# EAGLE schematic synth-a-phone-v1.4 (EAGLE 5.11)
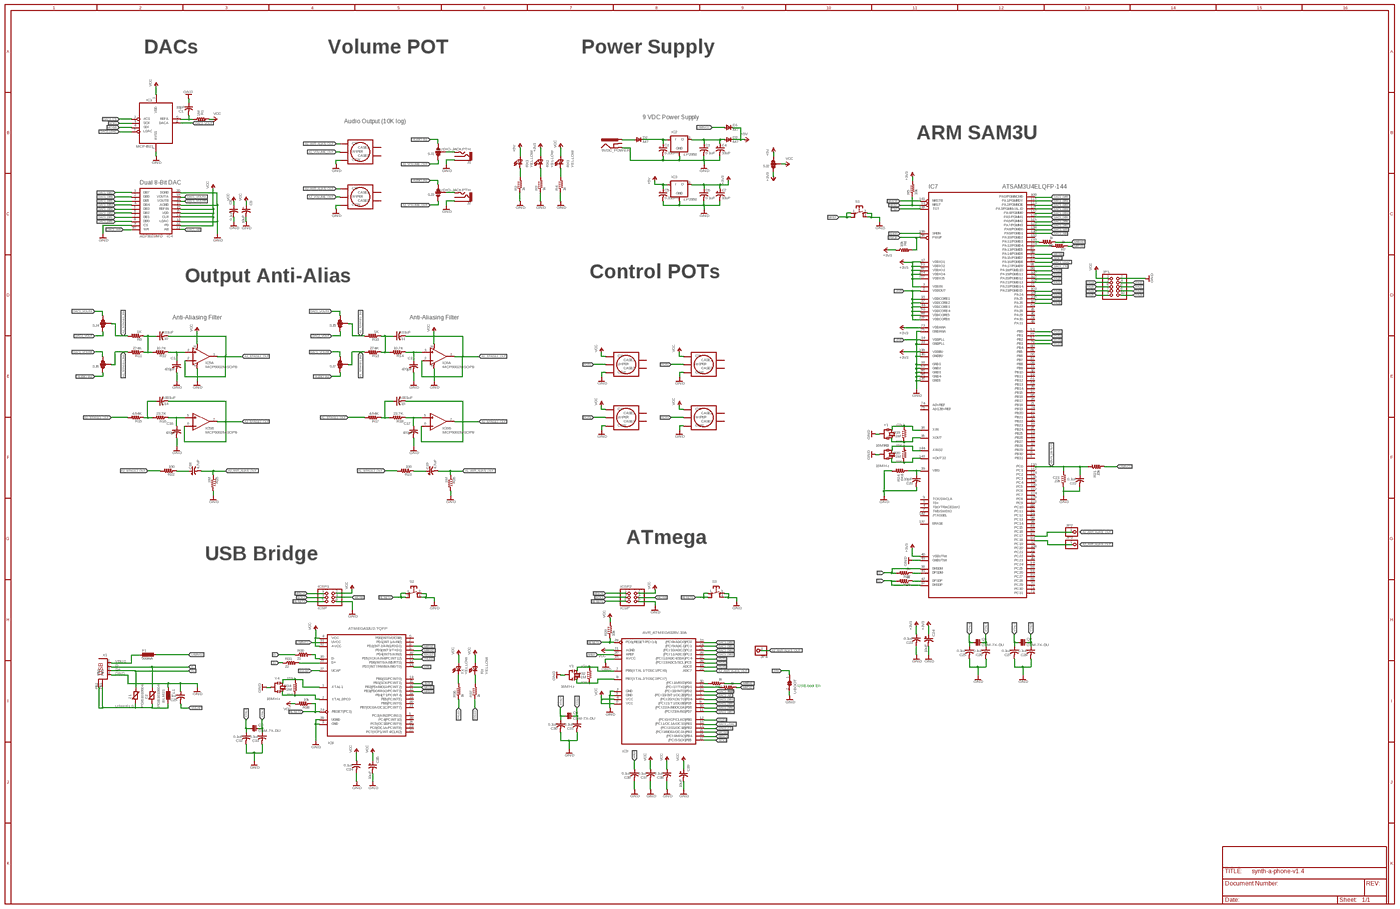
[diagram p0: schematic, sheet 1, overview]
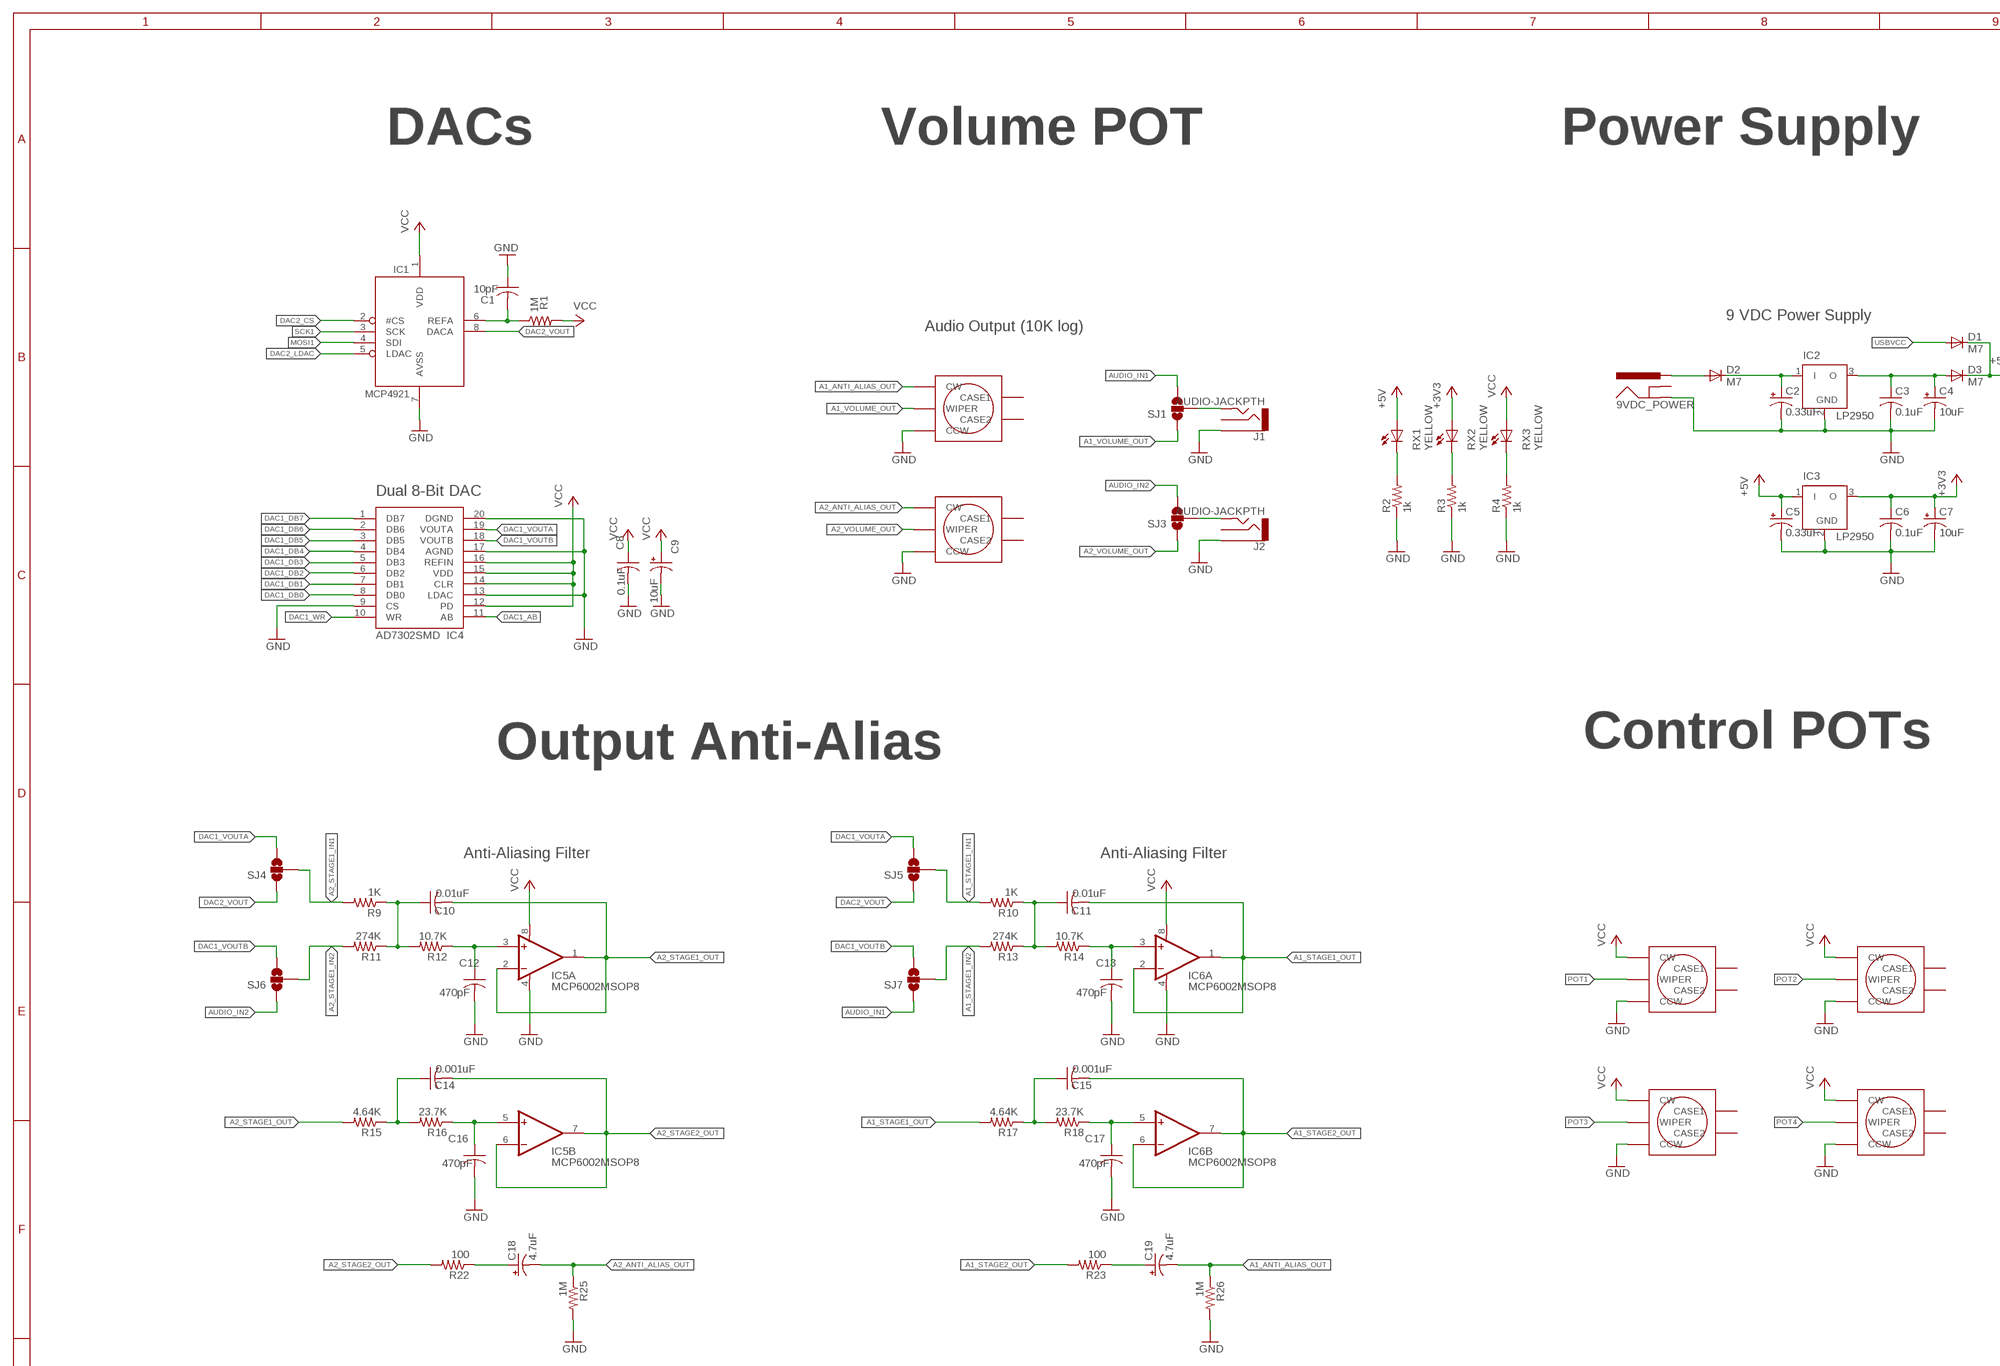
[diagram p1: schematic, sheet 1, part 1 of 4]
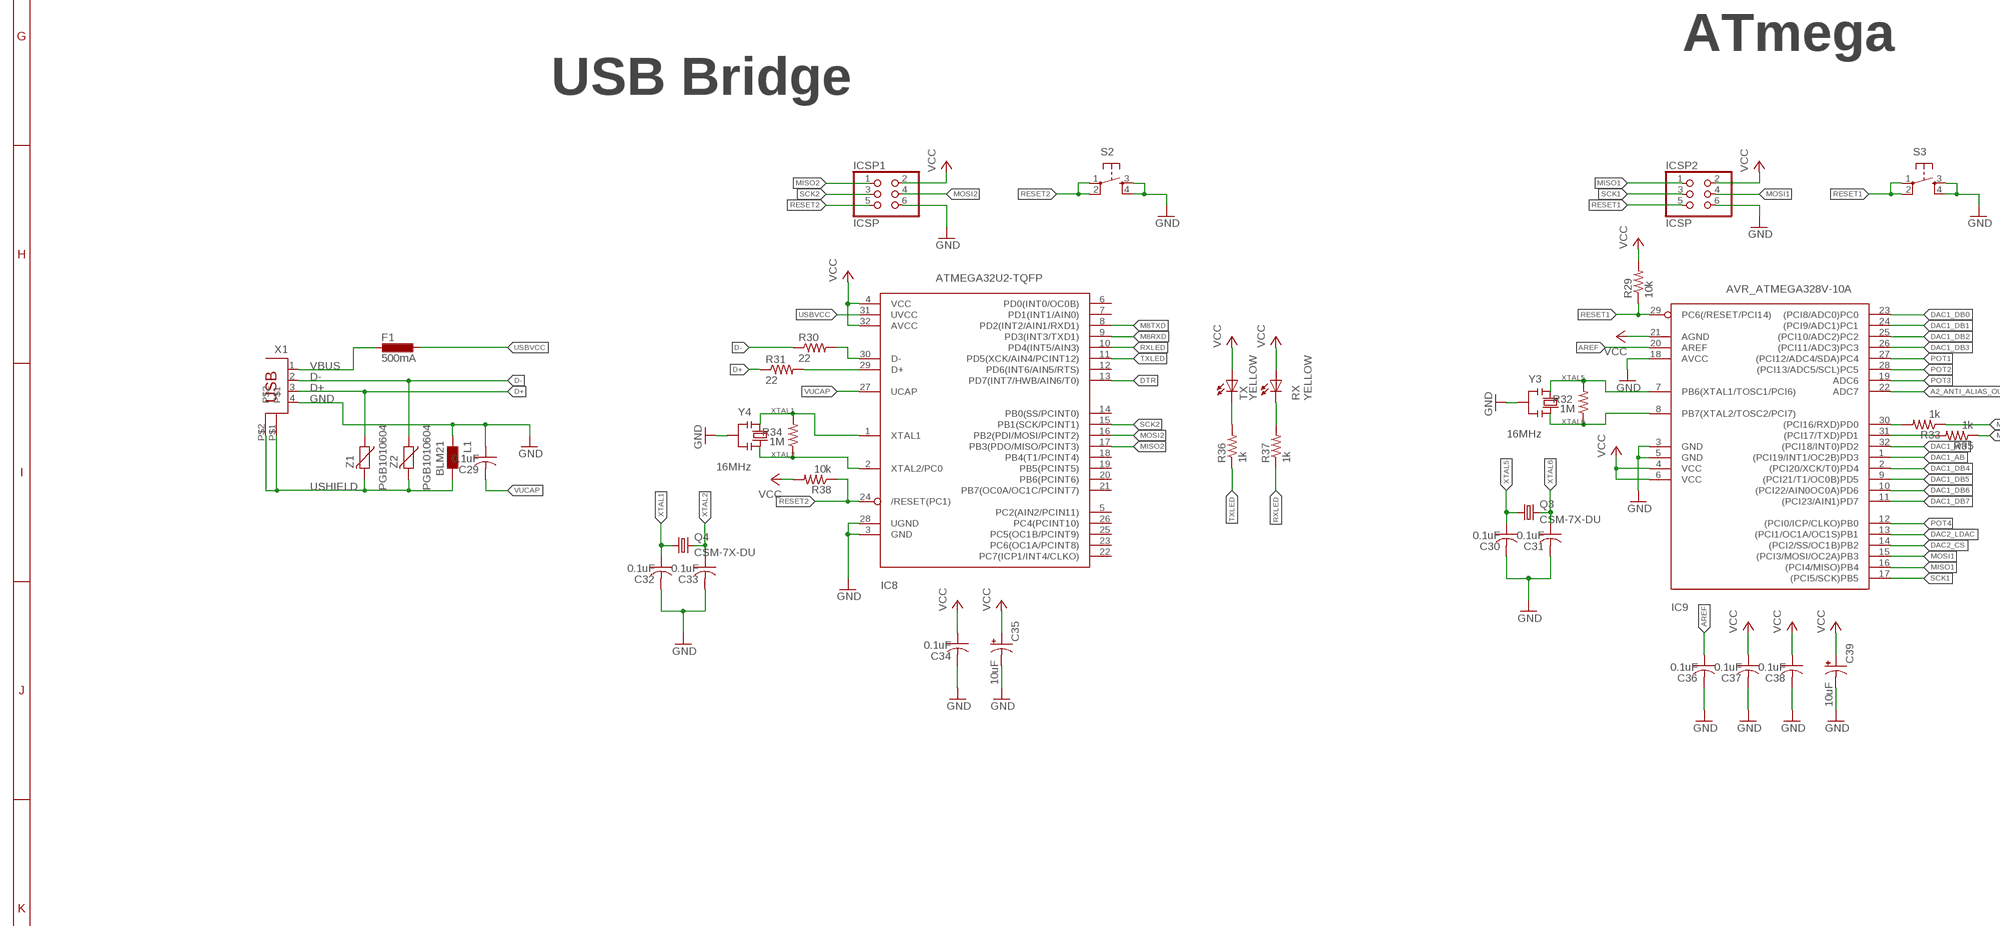
[diagram p2: schematic, sheet 1, part 2 of 4]
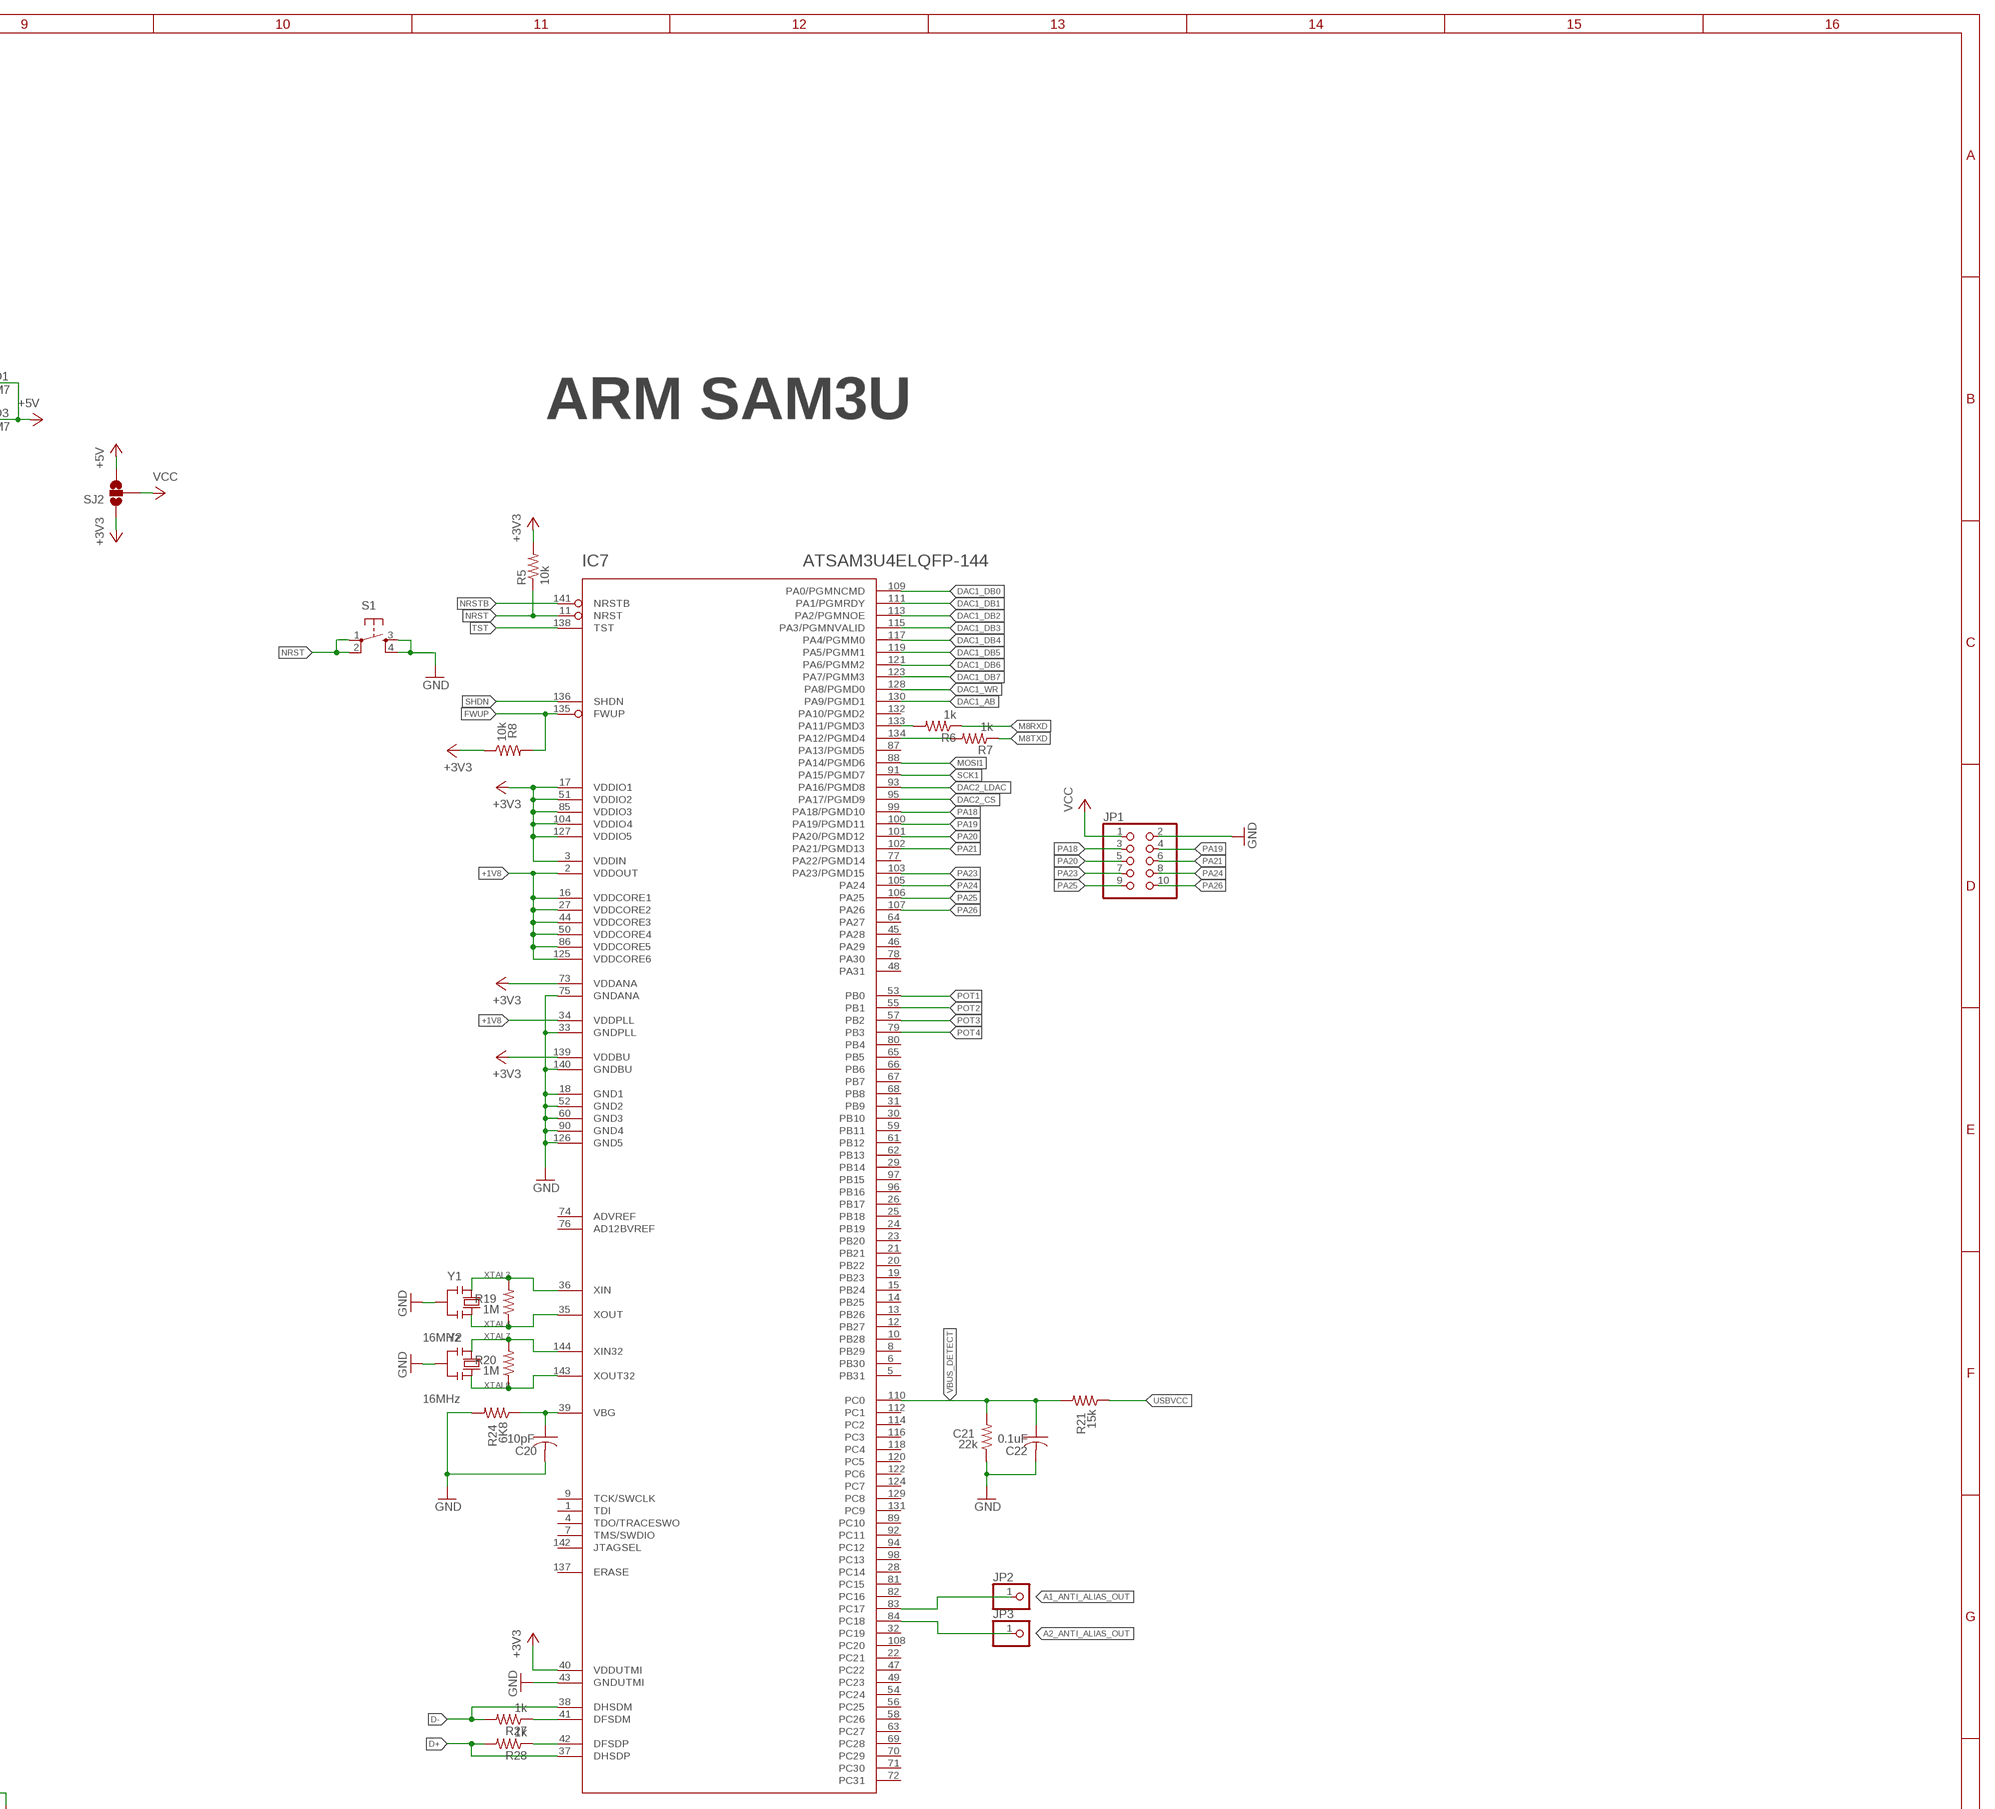
[diagram p3: schematic, sheet 1, part 3 of 4]
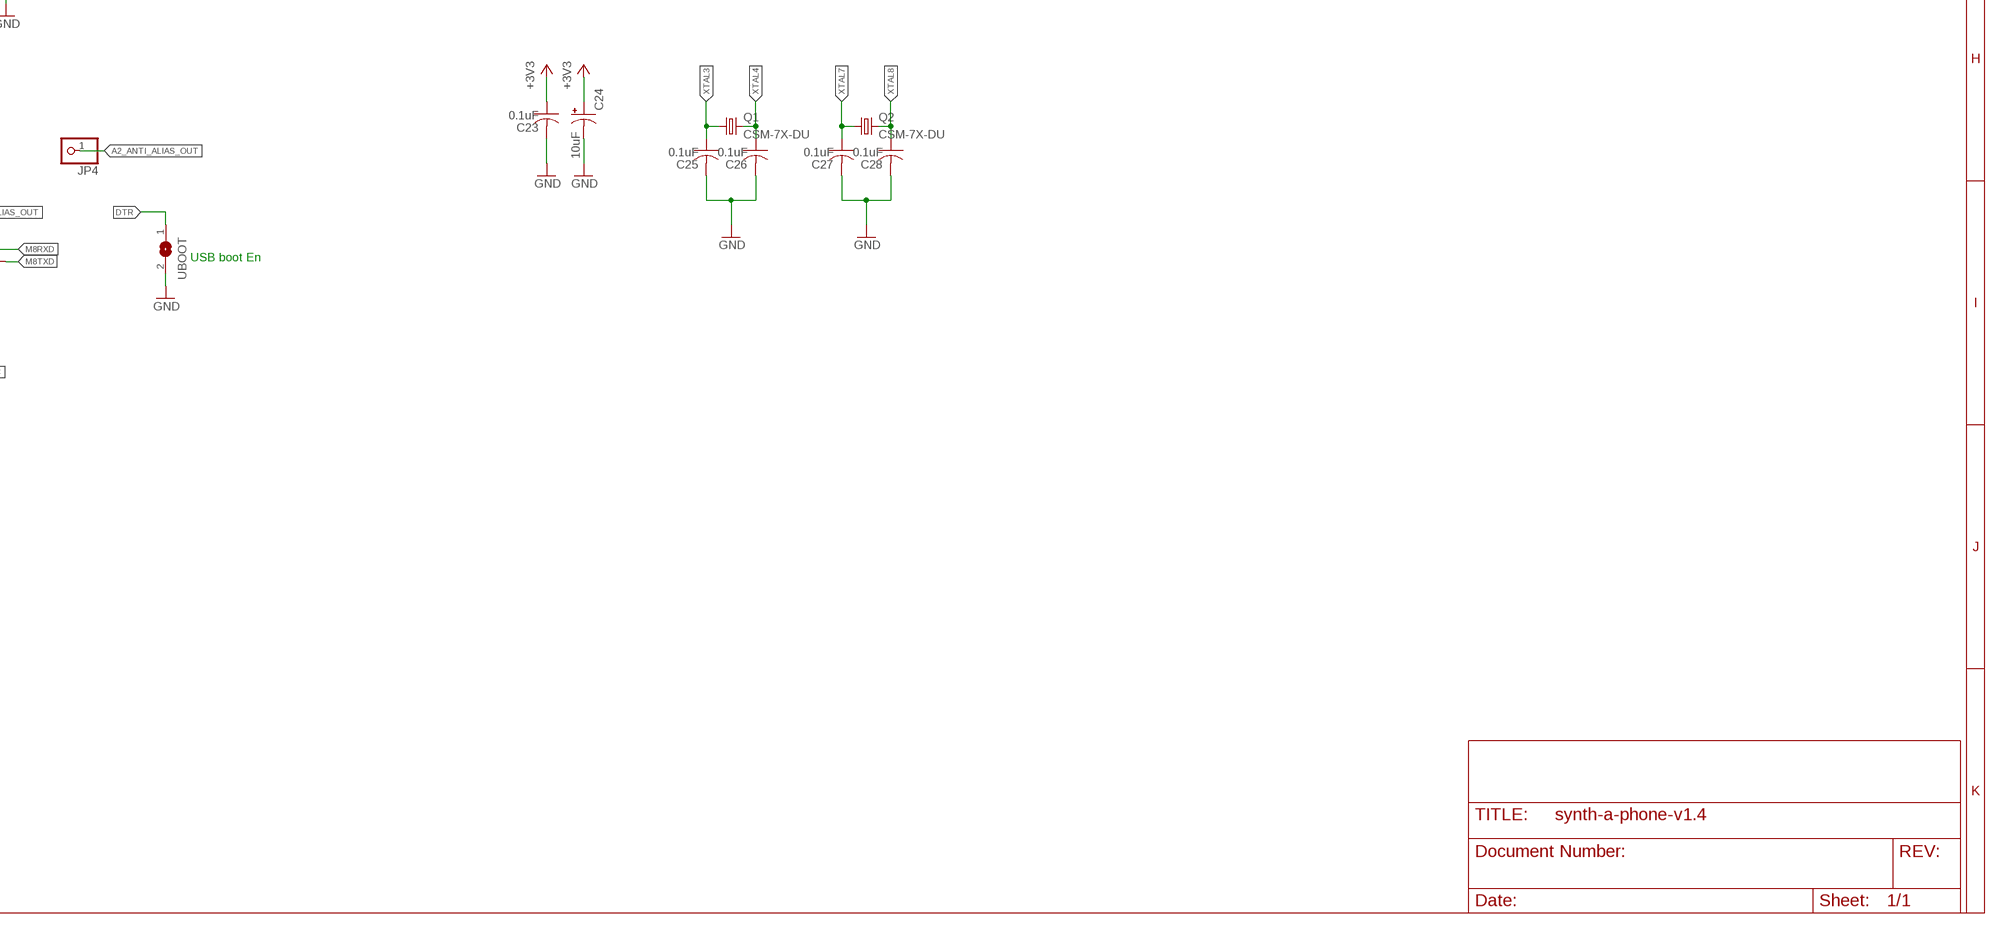
[diagram p4: schematic, sheet 1, part 4 of 4]

## Parts
9VDC_POWER  POWER_JACKPTH  [POWER_JACK_PTH]
C1  10pF  C-USC0603  [C0603]
C2  0.33uF  CPOL-USSMCA  [SMC_A]
C3  0.1uF  C-USC0603  [C0603]
C4  10uF  CPOL-USSMCA  [SMC_A]
C5  0.33uF  CPOL-USSMCA  [SMC_A]
C6  0.1uF  C-USC0603  [C0603]
C7  10uF  CPOL-USSMCA  [SMC_A]
C8  0.1uF  C-USC0603  [C0603]
C9  10uF  CPOL-USSMCA  [SMC_A]
C10  0.01uF  C-USC0603  [C0603]
C11  0.01uF  C-USC0603  [C0603]
C12  470pF  C-USC0603  [C0603]
C13  470pF  C-USC0603  [C0603]
C14  0.001uF  C-USC0603  [C0603]
C15  0.001uF  C-USC0603  [C0603]
C16  470pF  C-USC0603  [C0603]
C17  470pF  C-USC0603  [C0603]
C18  4.7uF  CPOL-USSMCA  [SMC_A]
C19  4.7uF  CPOL-USSMCA  [SMC_A]
C20  10pF  C-USC0603  [C0603]
C21  22k  R-US_R0603  [R0603]
C22  0.1uF  C-USC0603  [C0603]
C23  0.1uF  C-USC0603  [C0603]
C24  10uF  CPOL-USSMCA  [SMC_A]
C25  0.1uF  C-USC0603  [C0603]
C26  0.1uF  C-USC0603  [C0603]
C27  0.1uF  C-USC0603  [C0603]
C28  0.1uF  C-USC0603  [C0603]
C29  0.1uF  C-USC0603  [C0603]
C30  0.1uF  C-USC0603  [C0603]
C31  0.1uF  C-USC0603  [C0603]
C32  0.1uF  C-USC0603  [C0603]
C33  0.1uF  C-USC0603  [C0603]
C34  0.1uF  C-USC0603  [C0603]
C35  10uF  CPOL-USSMCA  [SMC_A]
C36  0.1uF  C-USC0603  [C0603]
C37  0.1uF  C-USC0603  [C0603]
C38  0.1uF  C-USC0603  [C0603]
C39  10uF  CPOL-USSMCA  [SMC_A]
D1  M7  DIODE-SMB  [SMB]
D2  M7  DIODE-SMB  [SMB]
D3  M7  DIODE-SMB  [SMB]
F1  500mA  L-EUL1812  [L1812]
IC1  MCP4921MSOP8  [MSOP8]
IC2  LP2950  [DPACK]
IC3  LP2950  [DPACK]
IC4  AD7302SMD  [TSSOP20]
IC5  MCP6002MSOP8  [MSOP8]
IC6  MCP6002MSOP8  [MSOP8]
IC7  ATSAM3U4ELQFP-144  [SQFP-S-20X20-144]
IC8  ATMEGA32U2-TQFP  [TQFP32-08]
IC9  AVR_ATMEGA328V-10A  [AVR_TQFP32-08]
ICSP1  ICSP  PINHD-2X3  [2X03]
ICSP2  ICSP  PINHD-2X3  [2X03]
J1  AUDIO-JACKPTH  [AUDIO-JACK]
J2  AUDIO-JACKPTH  [AUDIO-JACK]
JP1  PINHD-2X5  [2X05]
JP2  PINHD-1X1  [1X01]
JP3  PINHD-1X1  [1X01]
JP4  PINHD-1X1  [1X01]
L1  BLM21  WE-CBF_0805  [0805]
POT1  Volume  VACOLOCO_EVUFRK09_POT  [VACOLOCO_EVUF]
POT2  Volume  VACOLOCO_EVUFRK09_POT  [VACOLOCO_EVUF]
POT3  Volume  VACOLOCO_EVUFRK09_POT  [VACOLOCO_EVUF]
POT4  Volume  VACOLOCO_EVUFRK09_POT  [VACOLOCO_EVUF]
Q1  CSM-7X-DU  [CSM-7X-DU]
Q2  CSM-7X-DU  [CSM-7X-DU]
Q3  CSM-7X-DU  [CSM-7X-DU]
Q4  CSM-7X-DU  [CSM-7X-DU]
R1  1M  R-US_R0603  [R0603]
R2  1k  R-US_R0603  [R0603]
R3  1k  R-US_R0603  [R0603]
R4  1k  R-US_R0603  [R0603]
R5  10k  R-US_R0603  [R0603]
R6  1k  R-US_R0603  [R0603]
R7  1k  R-US_R0603  [R0603]
R8  10k  R-US_R0603  [R0603]
R9  1K  R-US_R0603  [R0603]
R10  1K  R-US_R0603  [R0603]
R11  274K  R-US_R0603  [R0603]
R12  10.7K  R-US_R0603  [R0603]
R13  274K  R-US_R0603  [R0603]
R14  10.7K  R-US_R0603  [R0603]
R15  4.64K  R-US_R0603  [R0603]
R16  23.7K  R-US_R0603  [R0603]
R17  4.64K  R-US_R0603  [R0603]
R18  23.7K  R-US_R0603  [R0603]
R19  1M  R-US_R0603  [R0603]
R20  1M  R-US_R0603  [R0603]
R21  15k  R-US_R0603  [R0603]
R22  100  R-US_R0603  [R0603]
R23  100  R-US_R0603  [R0603]
R24  6K8  R-US_R0603  [R0603]
R25  1M  R-US_R0603  [R0603]
R26  1M  R-US_R0603  [R0603]
R27  1k  R-US_R0603  [R0603]
R28  1k  R-US_R0603  [R0603]
R29  10k  R-US_R0603  [R0603]
R30  22  R-US_R0603  [R0603]
R31  22  R-US_R0603  [R0603]
R32  1M  R-US_R0603  [R0603]
R33  1k  R-US_R0603  [R0603]
R34  1M  R-US_R0603  [R0603]
R35  1k  R-US_R0603  [R0603]
R36  1k  R-US_R0603  [R0603]
R37  1k  R-US_R0603  [R0603]
R38  10k  R-US_R0603  [R0603]
RX  YELLOW  LEDCHIP-LED0805  [CHIP-LED0805]
RX1  YELLOW  LEDCHIP-LED0805  [CHIP-LED0805]
RX2  YELLOW  LEDCHIP-LED0805  [CHIP-LED0805]
RX3  YELLOW  LEDCHIP-LED0805  [CHIP-LED0805]
S1  TAC_SWITCHPTH  [TACTILE-PTH]
S2  TAC_SWITCHPTH  [TACTILE-PTH]
S3  TAC_SWITCHPTH  [TACTILE-PTH]
SJ1  SOLDERJUMPER_2WAYS  [SJ_3]
SJ2  SOLDERJUMPER_2WAYS  [SJ_3]
SJ3  SOLDERJUMPER_2WAYS  [SJ_3]
SJ4  SOLDERJUMPER_2WAYS  [SJ_3]
SJ5  SOLDERJUMPER_2WAYS  [SJ_3]
SJ6  SOLDERJUMPER_2WAYS  [SJ_3]
SJ7  SOLDERJUMPER_2WAYS  [SJ_3]
TX  YELLOW  LEDCHIP-LED0805  [CHIP-LED0805]
UBOOT  SJ  [SJ]
VOL1  Volume  VACOLOCO_EVUFRK09_POT  [VACOLOCO_EVUF]
VOL2  Volume  VACOLOCO_EVUFRK09_POT  [VACOLOCO_EVUF]
X1  PN61729  [PN61729]
Y1  16MHz  RESONATORMU  [RESONATOR]
Y2  16MHz  RESONATORMU  [RESONATOR]
Y3  16MHz  RESONATORMU  [RESONATOR]
Y4  16MHz  RESONATORMU  [RESONATOR]
Z1  PGB1010604  VARISTORCN0603  [CT/CN0603]
Z2  PGB1010604  VARISTORCN0603  [CT/CN0603]

## Nets
+1V8: IC7.2(VDDOUT) IC7.16(VDDCORE1) IC7.27(VDDCORE2) IC7.34(VDDPLL) IC7.44(VDDCORE3) IC7.50(VDDCORE4) IC7.86(VDDCORE5) IC7.125(VDDCORE6)
+3V3: C6.1 C7.+ C23.1 C24.+ IC3.3(O) IC7.3(VDDIN) IC7.17(VDDIO1) IC7.40(VDDUTMI) IC7.51(VDDIO2) IC7.73(VDDANA) IC7.85(VDDIO3) IC7.104(VDDIO4) IC7.127(VDDIO5) IC7.139(VDDBU) R5.2 R8.1 RX2.A SJ2.1
+5V: C5.+ D1.C D3.C IC3.1(I) RX1.A SJ2.3
A1_ANTI_ALIAS_OUT: C19.- IC7.83(PC17) JP2.1 R26.1 VOL1.CW
A1_STAGE1_IN1: R10.2 SJ5.2
A1_STAGE1_IN2: R13.2 SJ7.2
A1_STAGE1_OUT: C11.2 IC6.1(A:OUT) IC6.2(A:-IN) R17.2
A1_STAGE2_OUT: C15.2 IC6.6(B:-IN) IC6.7(B:OUT) R23.2
A1_VOLUME_OUT: SJ1.1 VOL1.WIPER
A2_ANTI_ALIAS_OUT: C18.- IC7.84(PC18) IC9.22(ADC7) JP3.1 JP4.1 R25.1 VOL2.CW
A2_STAGE1_IN1: R9.2 SJ4.2
A2_STAGE1_IN2: R11.2 SJ6.2
A2_STAGE1_OUT: C10.2 IC5.1(A:OUT) IC5.2(A:-IN) R15.2
A2_STAGE2_OUT: C14.2 IC5.6(B:-IN) IC5.7(B:OUT) R22.2
A2_VOLUME_OUT: SJ3.1 VOL2.WIPER
AREF: C36.1 IC9.20(AREF)
AUDIO_IN1: SJ1.3 SJ7.1
AUDIO_IN2: SJ3.3 SJ6.1
D+: IC7.37(DHSDP) R28.2 R31.1 X1.3 Z1.1
D-: IC7.38(DHSDM) R27.2 R30.1 X1.2 Z2.1
DAC1_AB: IC4.11(AB) IC7.130(PA9/PGMD1) IC9.1((PCI19/INT1/OC2B)PD3)
DAC1_DB0: IC4.8(DB0) IC7.109(PA0/PGMNCMD) IC9.23((PCI8/ADC0)PC0)
DAC1_DB1: IC4.7(DB1) IC7.111(PA1/PGMRDY) IC9.24((PCI9/ADC1)PC1)
DAC1_DB2: IC4.6(DB2) IC7.113(PA2/PGMNOE) IC9.25((PCI10/ADC2)PC2)
DAC1_DB3: IC4.5(DB3) IC7.115(PA3/PGMNVALID) IC9.26((PCI11/ADC3)PC3)
DAC1_DB4: IC4.4(DB4) IC7.117(PA4/PGMM0) IC9.2((PCI20/XCK/T0)PD4)
DAC1_DB5: IC4.3(DB5) IC7.119(PA5/PGMM1) IC9.9((PCI21/T1/OC0B)PD5)
DAC1_DB6: IC4.2(DB6) IC7.121(PA6/PGMM2) IC9.10((PCI22/AIN0OC0A)PD6)
DAC1_DB7: IC4.1(DB7) IC7.123(PA7/PGMM3) IC9.11((PCI23/AIN1)PD7)
DAC1_VOUTA: IC4.19(VOUTA) SJ4.3 SJ5.3
DAC1_VOUTB: IC4.18(VOUTB) SJ6.3 SJ7.3
DAC1_WR: IC4.10(WR) IC7.128(PA8/PGMD0) IC9.32((PCI18/INT0)PD2)
DAC2_CS: IC1.2(#CS) IC7.95(PA17/PGMD9) IC9.14((PCI2/SS/OC1B)PB2)
DAC2_LDAC: IC1.5(LDAC) IC7.93(PA16/PGMD8) IC9.13((PCI1/OC1A/OC1S)PB1)
DAC2_VOUT: IC1.8(DACA) SJ4.1 SJ5.1
DTR: IC8.13(PD7(INT7/HWB/AIN6/T0)) UBOOT.1
FWUP: IC7.135(FWUP) R8.2
GND: 9VDC_POWER.GND C1.1 C2.- C3.2 C4.- C5.- C6.2 C7.- C8.2 C9.- C12.2 C13.2 C16.2 C17.2 C20.2 C21.1 C22.2 C23.2 C24.- C25.2 C26.2 C27.2 C28.2 C29.1 C30.2 C31.2 C32.2 C33.2 C34.2 C35.- C36.2 C37.2 C38.2 C39.- IC1.7(AVSS) IC2.2(GND) IC3.2(GND) IC4.9(CS) IC4.13(LDAC) IC4.17(AGND) IC4.20(DGND) IC5.4(A:V-) IC6.4(A:V-) IC7.18(GND1) IC7.33(GNDPLL) IC7.43(GNDUTMI) IC7.52(GND2) IC7.60(GND3) IC7.75(GNDANA) IC7.90(GND4) IC7.126(GND5) IC7.140(GNDBU) IC8.3(GND) IC8.28(UGND) IC9.3(GND) IC9.5(GND) IC9.18(AVCC) ICSP1.6 ICSP2.6 J1.1 J2.1 JP1.2 L1.1 POT1.CCW POT2.CCW POT3.CCW POT4.CCW R2.1 R3.1 R4.1 R24.2 R25.2 R26.2 S1.3 S1.4 S2.3 S2.4 S3.3 S3.4 UBOOT.2 VOL1.CCW VOL2.CCW X1.4 Y1.2 Y2.2 Y3.2 Y4.2
IC6: C1.2 IC1.6(REFA) R1.1
M8RXD: IC8.9(PD3(INT3/TXD1)) R6.1 R33.1
M8TXD: IC8.8(PD2(INT2/AIN1/RXD1)) R7.1 R35.1
MISO1: IC9.16((PCI4/MISO)PB4) ICSP2.1
MISO2: IC8.17(PB3(PDO/MISO/PCINT3)) ICSP1.1
MOSI1: IC1.4(SDI) IC7.88(PA14/PGMD6) IC9.15((PCI3/MOSI/OC2A)PB3) ICSP2.4
MOSI2: IC8.16(PB2(PDI/MOSI/PCINT2)) ICSP1.4
N$1: IC7.41(DFSDM) R27.1
N$2: IC7.42(DFSDP) R28.1
N$3: R37.2 RX.C
N$4: R36.2 TX.C
N$5: C20.1 IC7.39(VBG) R24.1
N$6: R2.2 RX1.C
N$7: IC7.133(PA11/PGMD3) R6.2
N$8: IC9.30((PCI16/RXD)PD0) R33.2
N$9: IC9.31((PCI17/TXD)PD1) R35.2
N$10: IC7.134(PA12/PGMD4) R7.2
N$11: C3.1 C4.+ D3.A IC2.3(O)
N$15: R3.2 RX2.C
N$17: R4.2 RX3.C
N$18: C10.1 R9.1 R11.1 R12.2
N$19: C12.1 IC5.3(A:+IN) R12.1
N$20: C14.1 R15.1 R16.2
N$21: C19.+ R23.1
N$22: C16.1 IC5.5(B:+IN) R16.1
N$23: C18.+ R22.1
N$25: 9VDC_POWER.PWR D2.A
N$26: J2.5 SJ3.2
N$27: C2.+ D2.C IC2.1(I)
N$29: J1.5 SJ1.2
N$69: C11.1 R10.1 R13.1 R14.2
N$71: C13.1 IC6.3(A:+IN) R14.1
N$73: C15.1 R17.1 R18.2
N$74: C17.1 IC6.5(B:+IN) R18.1
NRST: IC7.11(NRST) R5.1 S1.1 S1.2
NRSTB: IC7.141(NRSTB)
PA18: IC7.99(PA18/PGMD10) JP1.3
PA19: IC7.100(PA19/PGMD11) JP1.4
PA20: IC7.101(PA20/PGMD12) JP1.5
PA21: IC7.102(PA21/PGMD13) JP1.6
PA23: IC7.103(PA23/PGMD15) JP1.7
PA24: IC7.105(PA24) JP1.8
PA25: IC7.106(PA25) JP1.9
PA26: IC7.107(PA26) JP1.10
POT1: IC7.53(PB0) IC9.27((PCI12/ADC4/SDA)PC4) POT1.WIPER
POT2: IC7.55(PB1) IC9.28((PCI13/ADC5/SCL)PC5) POT2.WIPER
POT3: IC7.57(PB2) IC9.19(ADC6) POT3.WIPER
POT4: IC7.79(PB3) IC9.12((PCI0/ICP/CLKO)PB0) POT4.WIPER
RD+: IC8.29(D+) R31.2
RD-: IC8.30(D-) R30.2
RESET1: IC9.29(PC6(/RESET/PCI14)) ICSP2.5 R29.1 S3.1 S3.2
RESET2: IC8.24(/RESET(PC1)) ICSP1.5 R38.1 S2.1 S2.2
RXLED: IC8.10(PD4(INT5/AIN3)) R37.1
SCK1: IC1.3(SCK) IC7.91(PA15/PGMD7) IC9.17((PCI5/SCK)PB5) ICSP2.3
SCK2: IC8.15(PB1(SCK/PCINT1)) ICSP1.3
SHDN: IC7.136(SHDN)
TST: IC7.138(TST)
TXLED: IC8.11(PD5(XCK/AIN4/PCINT12)) R36.1
USBVCC: D1.A F1.1 IC8.31(UVCC) R21.1
USHIELD: L1.2 X1.P$1 X1.P$2 Z1.2 Z2.2
VBUS: F1.2 X1.1
VBUS_DETECT: C21.2 C22.1 IC7.110(PC0) R21.2
VCC: C8.1 C9.+ C34.1 C35.+ C37.1 C38.1 C39.+ IC1.1(VDD) IC4.12(PD) IC4.14(CLR) IC4.15(VDD) IC4.16(REFIN) IC5.8(A:V+) IC6.8(A:V+) IC8.4(VCC) IC8.32(AVCC) IC9.4(VCC) IC9.6(VCC) IC9.21(AGND) ICSP1.2 ICSP2.2 JP1.1 POT1.CW POT2.CW POT3.CW POT4.CW R1.2 R29.2 R38.2 RX3.A RX.A SJ2.2 TX.A
VUCAP: C29.2 IC8.27(UCAP)
XTAL1: C32.1 IC8.1(XTAL1) Q4.1 R34.2 Y4.1
XTAL2: C33.1 IC8.2(XTAL2/PC0) Q4.2 R34.1 Y4.3
XTAL3: C25.1 IC7.36(XIN) Q1.1 R19.2 Y1.1
XTAL4: C26.1 IC7.35(XOUT) Q1.2 R19.1 Y1.3
XTAL5: C30.1 IC9.7(PB6(XTAL1/TOSC1/PCI6)) Q3.1 R32.2 Y3.1
XTAL6: C31.1 IC9.8(PB7(XTAL2/TOSC2/PCI7)) Q3.2 R32.1 Y3.3
XTAL7: C27.1 IC7.144(XIN32) Q2.1 R20.2 Y2.1
XTAL8: C28.1 IC7.143(XOUT32) Q2.2 R20.1 Y2.3
Unconnected: 9VDC_POWER.GNDBREAK IC7.1(TDI) IC7.4(TDO/TRACESWO) IC7.5(PB31) IC7.6(PB30) IC7.7(TMS/SWDIO) IC7.8(PB29) IC7.9(TCK/SWCLK) IC7.10(PB28) IC7.12(PB27) IC7.13(PB26) IC7.14(PB25) IC7.15(PB24) IC7.19(PB23) IC7.20(PB22) IC7.21(PB21) IC7.22(PC21) IC7.23(PB20) IC7.24(PB19) IC7.25(PB18) IC7.26(PB17) IC7.28(PC14) IC7.29(PB14) IC7.30(PB10) IC7.31(PB9) IC7.32(PC19) IC7.45(PA28) IC7.46(PA29) IC7.47(PC22) IC7.48(PA31) IC7.49(PC23) IC7.54(PC24) IC7.56(PC25) IC7.58(PC26) IC7.59(PB11) IC7.61(PB12) IC7.62(PB13) IC7.63(PC27) IC7.64(PA27) IC7.65(PB5) IC7.66(PB6) IC7.67(PB7) IC7.68(PB8) IC7.69(PC28) IC7.70(PC29) IC7.71(PC30) IC7.72(PC31) IC7.74(ADVREF) IC7.76(AD12BVREF) IC7.77(PA22/PGMD14) IC7.78(PA30) IC7.80(PB4) IC7.81(PC15) IC7.82(PC16) IC7.87(PA13/PGMD5) IC7.89(PC10) IC7.92(PC11) IC7.94(PC12) IC7.96(PB16) IC7.97(PB15) IC7.98(PC13) IC7.108(PC20) IC7.112(PC1) IC7.114(PC2) IC7.116(PC3) IC7.118(PC4) IC7.120(PC5) IC7.122(PC6) IC7.124(PC7) IC7.129(PC8) IC7.131(PC9) IC7.132(PA10/PGMD2) IC7.137(ERASE) IC7.142(JTAGSEL) IC8.5(PC2(AIN2/PCIN11)) IC8.6(PD0(INT0/OC0B)) IC8.7(PD1(INT1/AIN0)) IC8.12(PD6(INT6/AIN5/RTS)) IC8.14(PB0(SS/PCINT0)) IC8.18(PB4(T1/PCINT4)) IC8.19(PB5(PCINT5)) IC8.20(PB6(PCINT6)) IC8.21(PB7(OC0A/OC1C/PCINT7)) IC8.22(PC7(ICP1/INT4/CLKO)) IC8.23(PC6(OC1A/PCINT8)) IC8.25(PC5(OC1B/PCINT9)) IC8.26(PC4(PCINT10)) J1.2 J2.2 POT1.CASE1 POT1.CASE2 POT2.CASE1 POT2.CASE2 POT3.CASE1 POT3.CASE2 POT4.CASE1 POT4.CASE2 VOL1.CASE1 VOL1.CASE2 VOL2.CASE1 VOL2.CASE2

## Notes on the sheet
- DACs | Volume POT | Power Supply
- 9 VDC Power Supply
- Audio Output (10K log)
- ARM SAM3U
- Dual 8-Bit DAC
- Output Anti-Alias | Control POTs
- Anti-Aliasing Filter | Anti-Aliasing Filter
- ATmega
- USB Bridge
- USB boot En

## Library data of the parts
9VDC_POWER = meeblip:POWER_JACK: Power Jack 5.5mm barrel jack for optional 9 VDC power input.
C1 C3 C6 C8 C10-C17 C20 C22 C23 C25-C34 C36-C38 = rcl:C-US: CAPACITOR, American symbol
C2 C4 C5 C7 C9 C18 C19 C24 C35 C39 = rcl:CPOL-US: POLARIZED CAPACITOR, American symbol
C21 R1-R38 = rcl:R-US_: RESISTOR, American symbol
D1-D3 = diode:DIODE-: DIODE
F1 = rcl:L-EU: INDUCTOR, European symbol
IC1 = Sparky:MCP4921
IC2 IC3 = linear:LP2950: 100 mA, Low Power Low Dropout Voltage Regulator Source: http://www.onsemi.com/pub/Collateral/LP2950-D.PDF
IC4 = SparkFun:AD7302: AD7302
IC5 IC6 = Sparky:MCP6002: Dual Op Amp
IC7 = Sparky:ATSAM3U4E
IC8 = adafruit:ATMEGA32U2: ATmega32u2 Pin compatible with the atmega8u2, atmega16u2 and atmega32u2 8, 16 or 32 K flash, 1K RAM, 512b EEPROM 8 bit and 16 bit timer (5 PWM total) UART, SPI (no I2C!) USB with 4 endpoints, LUFA compatible 22 I/O lines, analog comparator (no ADC!) Comes with DFU bootloader burned in!
IC9 = avr:AVR_ATMEGA328: MICROCONTROLLER 32 kBytes FLASH 1 kBytes SRAM 512 Bytes EEPROM USART 8-channel 10 bit ADC
ICSP1 ICSP2 = pinhead:PINHD-2X3: PIN HEADER
J1 J2 = SparkFun:AUDIO-JACK: 3.5mm Audio Jack Simple 3.5mm common PCB mount audio jack. SKU: PRT-08032
JP1 = pinhead:PINHD-2X5: PIN HEADER
JP2-JP4 = adafruit:PINHD-1X1: Pin header 1x1 for 0.1" spacing With round pins
L1 = wuerth-elektronik:WE-CBF: SMD EMI Suppression Ferrite Beads - excellent anti-EMI properties - low DCR - impedances till 3000 ohms - rated current up to 6 A
POT1-POT4 VOL1 VOL2 = meeblip:VACOLOCO_EVUF: Panasonic EVUF type potentionmeter Vertical Mount
Q1-Q4 = crystal:CSM-7X-DU: SMD CRYSTAL Source: www.ecsxtal.com .. Crystal 3.6864MHz CSM_7X_DU.PDF; OC_FARNELL: unknown; OC_NEWARK: unknown
RX RX1-RX3 TX = led:LED: LED OSRAM: - CHIPLED LG R971, LG N971, LY N971, LG Q971, LY Q971, LO R971, LY R971 LH N974, LH R974 LS Q976, LO Q976, LY Q976 LO Q996 - Hyper CHIPLED LW Q18S LB Q993, LB Q99A, LB R99A - SideLED LS A670, LO A670, LY A670, LG A670, LP A670 LB A673, LV A673, LT A673, LW A673 LH A674 LY A675 LS A676, LA A676, LO A676, LY A676, LW A676 LS A679, LY A679, LG A679 - Hyper Micro SIDELED® LS Y876, LA Y876, LO Y876, LY Y876 LT Y87S - SmartLED LW L88C, LW L88S LB L89C, LB L89S, LG L890 LS L89K, LO L89K, LY L89K LS L896, LA L896, LO L896, LY L896 - TOPLED LS T670, LO T670, LY T670, LG T670, LP T670 LSG T670, LSP T670, LSY T670, LOP T670, LYG T670 LG T671, LOG T671, LSG T671 LB T673, LV T673, LT T673, LW T673 LH T674 LS T676, LA T676, LO T676, LY T676, LB T676, LH T676, LSB T676, LW T676 LB T67C, LV T67C, LT T67C, LS T67K, LO T67K, LY T67K, LW E67C LS E67B, LA E67B, LO E67B, LY E67B, LB E67C, LV E67C, LT E67C LW T67C LS T679, LY T679, LG T679 LS T770, LO T770, LY T770, LG T770, LP T770 LB T773, LV T773, LT T773, LW T773 LH T774 LS E675, LA E675, LY E675, LS T675 LS T776, LA T776, LO T776, LY T776, LB T776 LHGB T686 LT T68C, LB T68C - Hyper Mini TOPLED® LB M676 - Mini TOPLED Santana® LG M470 LS M47K, LO M47K, LY M47K Source: http://www.osram.convergy.de LUXEON: - LUMILED® LXK2-PW12-R00, LXK2-PW12-S00, LXK2-PW14-U00, LXK2-PW14-V00 LXK2-PM12-R00, LXK2-PM12-S00, LXK2-PM14-U00 LXK2-PE12-Q00, LXK2-PE12-R00, LXK2-PE12-S00, LXK2-PE14-T00, LXK2-PE14-U00 LXK2-PB12-K00, LXK2-PB12-L00, LXK2-PB12-M00, LXK2-PB14-N00, LXK2-PB14-P00, LXK2-PB14-Q00 LXK2-PR12-L00, LXK2-PR12-M00, LXK2-PR14-Q00, LXK2-PR14-R00 LXK2-PD12-Q00, LXK2-PD12-R00, LXK2-PD12-S00 LXK2-PH12-R00, LXK2-PH12-S00 LXK2-PL12-P00, LXK2-PL12-Q00, LXK2-PL12-R00 Source: www.luxeon.com KINGBRIGHT: KA-3528ASYC Source: www.kingbright.com
S1-S3 = SparkFun:TAC_SWITCH: Momentary Switch Button commonly used for reset or general input. Spark Fun Electronics SKU : COM-00097
SJ1-SJ7 = SparkFun:SOLDERJUMPER_2WAY: Solder Jumper 2 way solder jumper
UBOOT = jumper:SJ: SMD solder JUMPER
X1 = SmartPrj:PN61729: BERG USB connector
Y1-Y4 = SmartPrj:RESONATOR
Z1 Z2 = varistor:VARISTOR: VARISTOR